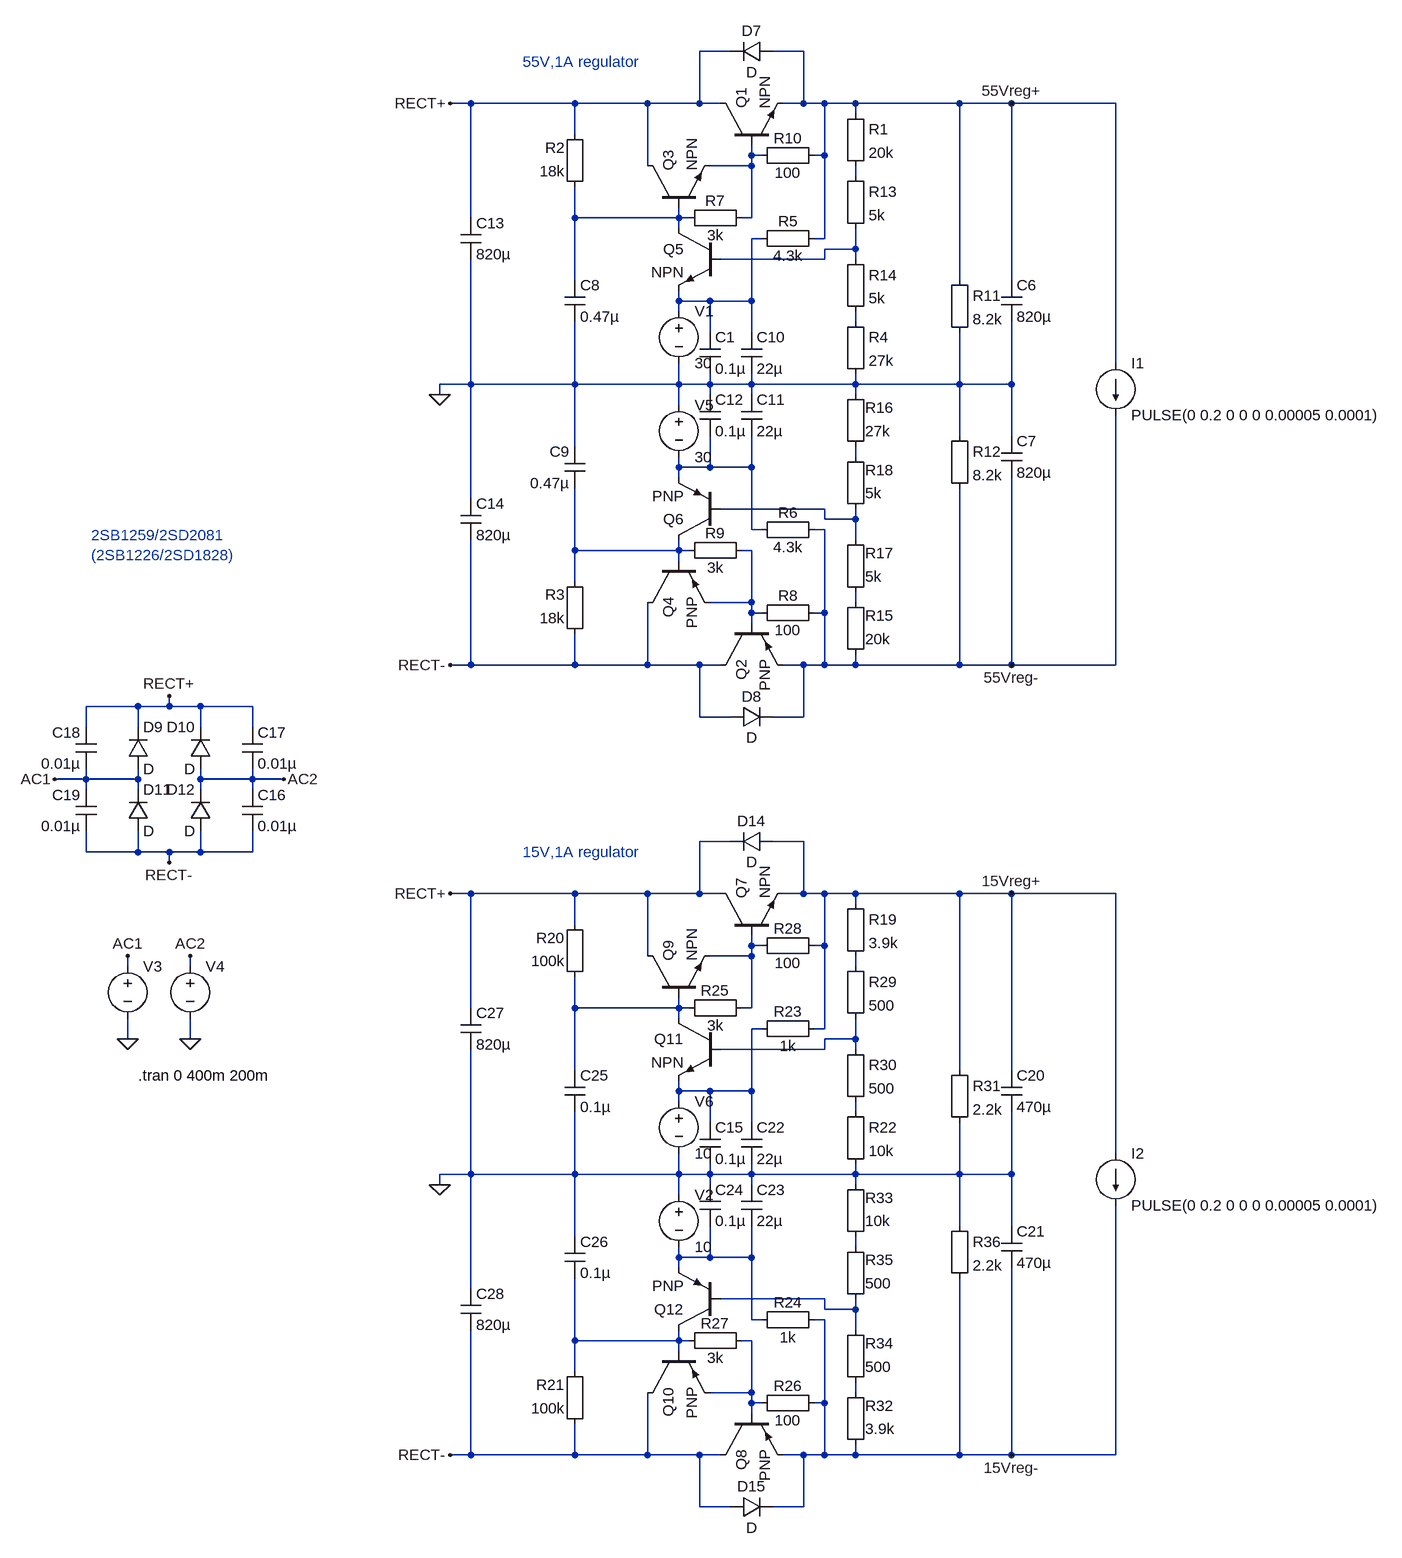
[diagram p0: schematic concept_1_duo.asc]
concept_1_duo.asc, the LTspice schematic file:
Version 4
SHEET 1 880 680
WIRE -2032 -2576 -2080 -2576
WIRE -1920 -2576 -1968 -2576
WIRE -2432 -2496 -2464 -2496
WIRE -2272 -2496 -2432 -2496
WIRE -2160 -2496 -2272 -2496
WIRE -2080 -2496 -2080 -2576
WIRE -2080 -2496 -2160 -2496
WIRE -2048 -2496 -2080 -2496
WIRE -1920 -2496 -1920 -2576
WIRE -1920 -2496 -1952 -2496
WIRE -1888 -2496 -1920 -2496
WIRE -1840 -2496 -1888 -2496
WIRE -1680 -2496 -1840 -2496
WIRE -1600 -2496 -1680 -2496
WIRE -1440 -2496 -1600 -2496
WIRE -1840 -2480 -1840 -2496
WIRE -2272 -2448 -2272 -2496
WIRE -2000 -2416 -2000 -2432
WIRE -1984 -2416 -2000 -2416
WIRE -1888 -2416 -1888 -2496
WIRE -1888 -2416 -1904 -2416
WIRE -2160 -2400 -2160 -2496
WIRE -2000 -2400 -2000 -2416
WIRE -2000 -2400 -2064 -2400
WIRE -1840 -2384 -1840 -2400
WIRE -2432 -2320 -2432 -2496
WIRE -2272 -2320 -2272 -2368
WIRE -2112 -2320 -2112 -2336
WIRE -2112 -2320 -2272 -2320
WIRE -2096 -2320 -2112 -2320
WIRE -2000 -2320 -2000 -2400
WIRE -2000 -2320 -2016 -2320
WIRE -2112 -2304 -2112 -2320
WIRE -1984 -2288 -2000 -2288
WIRE -1888 -2288 -1888 -2416
WIRE -1888 -2288 -1904 -2288
WIRE -1840 -2272 -1840 -2304
WIRE -1840 -2272 -1888 -2272
WIRE -1888 -2256 -1888 -2272
WIRE -1888 -2256 -2048 -2256
WIRE -1840 -2256 -1840 -2272
WIRE -2272 -2224 -2272 -2320
WIRE -1680 -2224 -1680 -2496
WIRE -1600 -2224 -1600 -2496
WIRE -2112 -2192 -2112 -2208
WIRE -2064 -2192 -2112 -2192
WIRE -2000 -2192 -2000 -2288
WIRE -2000 -2192 -2064 -2192
WIRE -2112 -2176 -2112 -2192
WIRE -1840 -2160 -1840 -2176
WIRE -2064 -2144 -2064 -2192
WIRE -2000 -2144 -2000 -2192
WIRE -1440 -2096 -1440 -2496
WIRE -2432 -2064 -2432 -2256
WIRE -2432 -2064 -2480 -2064
WIRE -2272 -2064 -2272 -2160
WIRE -2272 -2064 -2432 -2064
WIRE -2112 -2064 -2112 -2096
WIRE -2112 -2064 -2272 -2064
WIRE -2064 -2064 -2064 -2080
WIRE -2064 -2064 -2112 -2064
WIRE -2000 -2064 -2000 -2080
WIRE -2000 -2064 -2064 -2064
WIRE -1840 -2064 -1840 -2080
WIRE -1840 -2064 -2000 -2064
WIRE -1680 -2064 -1680 -2144
WIRE -1680 -2064 -1840 -2064
WIRE -1600 -2064 -1600 -2160
WIRE -1600 -2064 -1680 -2064
WIRE -2480 -2048 -2480 -2064
WIRE -2064 -2048 -2064 -2064
WIRE -2000 -2048 -2000 -2064
WIRE -1840 -2048 -1840 -2064
WIRE -2112 -2032 -2112 -2064
WIRE -1680 -1984 -1680 -2064
WIRE -1600 -1984 -1600 -2064
WIRE -2272 -1968 -2272 -2064
WIRE -1840 -1952 -1840 -1968
WIRE -2112 -1936 -2112 -1952
WIRE -2064 -1936 -2064 -1984
WIRE -2064 -1936 -2112 -1936
WIRE -2000 -1936 -2000 -1984
WIRE -2000 -1936 -2064 -1936
WIRE -2112 -1920 -2112 -1936
WIRE -2432 -1888 -2432 -2064
WIRE -1888 -1872 -2048 -1872
WIRE -1888 -1856 -1888 -1872
WIRE -1840 -1856 -1840 -1872
WIRE -1840 -1856 -1888 -1856
WIRE -2000 -1840 -2000 -1936
WIRE -1984 -1840 -2000 -1840
WIRE -1888 -1840 -1904 -1840
WIRE -1840 -1824 -1840 -1856
WIRE -2272 -1808 -2272 -1904
WIRE -2112 -1808 -2112 -1824
WIRE -2112 -1808 -2272 -1808
WIRE -2096 -1808 -2112 -1808
WIRE -2000 -1808 -2016 -1808
WIRE -2112 -1792 -2112 -1808
WIRE -2272 -1760 -2272 -1808
WIRE -2000 -1728 -2000 -1808
WIRE -2000 -1728 -2064 -1728
WIRE -1840 -1728 -1840 -1744
WIRE -2000 -1712 -2000 -1728
WIRE -1984 -1712 -2000 -1712
WIRE -1888 -1712 -1888 -1840
WIRE -1888 -1712 -1904 -1712
WIRE -2000 -1696 -2000 -1712
WIRE -2432 -1632 -2432 -1824
WIRE -2432 -1632 -2464 -1632
WIRE -2272 -1632 -2272 -1680
WIRE -2272 -1632 -2432 -1632
WIRE -2160 -1632 -2160 -1728
WIRE -2160 -1632 -2272 -1632
WIRE -2080 -1632 -2160 -1632
WIRE -2048 -1632 -2080 -1632
WIRE -1920 -1632 -1952 -1632
WIRE -1888 -1632 -1888 -1712
WIRE -1888 -1632 -1920 -1632
WIRE -1840 -1632 -1840 -1648
WIRE -1840 -1632 -1888 -1632
WIRE -1680 -1632 -1680 -1904
WIRE -1680 -1632 -1840 -1632
WIRE -1600 -1632 -1600 -1920
WIRE -1600 -1632 -1680 -1632
WIRE -1440 -1632 -1440 -2016
WIRE -1440 -1632 -1600 -1632
WIRE -2944 -1568 -3024 -1568
WIRE -2896 -1568 -2896 -1584
WIRE -2896 -1568 -2944 -1568
WIRE -2848 -1568 -2896 -1568
WIRE -2768 -1568 -2848 -1568
WIRE -2080 -1552 -2080 -1632
WIRE -2032 -1552 -2080 -1552
WIRE -1920 -1552 -1920 -1632
WIRE -1920 -1552 -1968 -1552
WIRE -3024 -1536 -3024 -1568
WIRE -2944 -1536 -2944 -1568
WIRE -2848 -1536 -2848 -1568
WIRE -2768 -1536 -2768 -1568
WIRE -3024 -1456 -3024 -1472
WIRE -3024 -1456 -3072 -1456
WIRE -2944 -1456 -2944 -1472
WIRE -2944 -1456 -3024 -1456
WIRE -2848 -1456 -2848 -1472
WIRE -2768 -1456 -2768 -1472
WIRE -2768 -1456 -2848 -1456
WIRE -2720 -1456 -2768 -1456
WIRE -3024 -1440 -3024 -1456
WIRE -2944 -1440 -2944 -1456
WIRE -2848 -1440 -2848 -1456
WIRE -2768 -1440 -2768 -1456
WIRE -2032 -1360 -2080 -1360
WIRE -1920 -1360 -1968 -1360
WIRE -3024 -1344 -3024 -1376
WIRE -2944 -1344 -2944 -1376
WIRE -2944 -1344 -3024 -1344
WIRE -2896 -1344 -2944 -1344
WIRE -2848 -1344 -2848 -1376
WIRE -2848 -1344 -2896 -1344
WIRE -2768 -1344 -2768 -1376
WIRE -2768 -1344 -2848 -1344
WIRE -2896 -1328 -2896 -1344
WIRE -2432 -1280 -2464 -1280
WIRE -2272 -1280 -2432 -1280
WIRE -2160 -1280 -2272 -1280
WIRE -2080 -1280 -2080 -1360
WIRE -2080 -1280 -2160 -1280
WIRE -2048 -1280 -2080 -1280
WIRE -1920 -1280 -1920 -1360
WIRE -1920 -1280 -1952 -1280
WIRE -1888 -1280 -1920 -1280
WIRE -1840 -1280 -1888 -1280
WIRE -1680 -1280 -1840 -1280
WIRE -1600 -1280 -1680 -1280
WIRE -1440 -1280 -1600 -1280
WIRE -1840 -1264 -1840 -1280
WIRE -2272 -1232 -2272 -1280
WIRE -2000 -1200 -2000 -1216
WIRE -1984 -1200 -2000 -1200
WIRE -1888 -1200 -1888 -1280
WIRE -1888 -1200 -1904 -1200
WIRE -2160 -1184 -2160 -1280
WIRE -2000 -1184 -2000 -1200
WIRE -2000 -1184 -2064 -1184
WIRE -2960 -1168 -2960 -1184
WIRE -2864 -1168 -2864 -1184
WIRE -1840 -1168 -1840 -1184
WIRE -2432 -1104 -2432 -1280
WIRE -2272 -1104 -2272 -1152
WIRE -2112 -1104 -2112 -1120
WIRE -2112 -1104 -2272 -1104
WIRE -2096 -1104 -2112 -1104
WIRE -2000 -1104 -2000 -1184
WIRE -2000 -1104 -2016 -1104
WIRE -2112 -1088 -2112 -1104
WIRE -1984 -1072 -2000 -1072
WIRE -1888 -1072 -1888 -1200
WIRE -1888 -1072 -1904 -1072
WIRE -2960 -1056 -2960 -1088
WIRE -2864 -1056 -2864 -1088
WIRE -1840 -1056 -1840 -1088
WIRE -1840 -1056 -1888 -1056
WIRE -1888 -1040 -1888 -1056
WIRE -1888 -1040 -2048 -1040
WIRE -1840 -1040 -1840 -1056
WIRE -2272 -1008 -2272 -1104
WIRE -1680 -1008 -1680 -1280
WIRE -1600 -1008 -1600 -1280
WIRE -2112 -976 -2112 -992
WIRE -2064 -976 -2112 -976
WIRE -2000 -976 -2000 -1072
WIRE -2000 -976 -2064 -976
WIRE -2112 -960 -2112 -976
WIRE -1840 -944 -1840 -960
WIRE -2064 -928 -2064 -976
WIRE -2000 -928 -2000 -976
WIRE -1440 -880 -1440 -1280
WIRE -2432 -848 -2432 -1040
WIRE -2432 -848 -2480 -848
WIRE -2272 -848 -2272 -944
WIRE -2272 -848 -2432 -848
WIRE -2112 -848 -2112 -880
WIRE -2112 -848 -2272 -848
WIRE -2064 -848 -2064 -864
WIRE -2064 -848 -2112 -848
WIRE -2000 -848 -2000 -864
WIRE -2000 -848 -2064 -848
WIRE -1840 -848 -1840 -864
WIRE -1840 -848 -2000 -848
WIRE -1680 -848 -1680 -928
WIRE -1680 -848 -1840 -848
WIRE -1600 -848 -1600 -944
WIRE -1600 -848 -1680 -848
WIRE -2480 -832 -2480 -848
WIRE -2064 -832 -2064 -848
WIRE -2000 -832 -2000 -848
WIRE -1840 -832 -1840 -848
WIRE -2112 -816 -2112 -848
WIRE -1680 -768 -1680 -848
WIRE -1600 -768 -1600 -848
WIRE -2272 -752 -2272 -848
WIRE -1840 -736 -1840 -752
WIRE -2112 -720 -2112 -736
WIRE -2064 -720 -2064 -768
WIRE -2064 -720 -2112 -720
WIRE -2000 -720 -2000 -768
WIRE -2000 -720 -2064 -720
WIRE -2112 -704 -2112 -720
WIRE -2432 -672 -2432 -848
WIRE -1888 -656 -2048 -656
WIRE -1888 -640 -1888 -656
WIRE -1840 -640 -1840 -656
WIRE -1840 -640 -1888 -640
WIRE -2000 -624 -2000 -720
WIRE -1984 -624 -2000 -624
WIRE -1888 -624 -1904 -624
WIRE -1840 -608 -1840 -640
WIRE -2272 -592 -2272 -688
WIRE -2112 -592 -2112 -608
WIRE -2112 -592 -2272 -592
WIRE -2096 -592 -2112 -592
WIRE -2000 -592 -2016 -592
WIRE -2112 -576 -2112 -592
WIRE -2272 -544 -2272 -592
WIRE -2000 -512 -2000 -592
WIRE -2000 -512 -2064 -512
WIRE -1840 -512 -1840 -528
WIRE -2000 -496 -2000 -512
WIRE -1984 -496 -2000 -496
WIRE -1888 -496 -1888 -624
WIRE -1888 -496 -1904 -496
WIRE -2000 -480 -2000 -496
WIRE -2432 -416 -2432 -608
WIRE -2432 -416 -2464 -416
WIRE -2272 -416 -2272 -464
WIRE -2272 -416 -2432 -416
WIRE -2160 -416 -2160 -512
WIRE -2160 -416 -2272 -416
WIRE -2080 -416 -2160 -416
WIRE -2048 -416 -2080 -416
WIRE -1920 -416 -1952 -416
WIRE -1888 -416 -1888 -496
WIRE -1888 -416 -1920 -416
WIRE -1840 -416 -1840 -432
WIRE -1840 -416 -1888 -416
WIRE -1680 -416 -1680 -688
WIRE -1680 -416 -1840 -416
WIRE -1600 -416 -1600 -704
WIRE -1600 -416 -1680 -416
WIRE -1440 -416 -1440 -800
WIRE -1440 -416 -1600 -416
WIRE -2080 -336 -2080 -416
WIRE -2032 -336 -2080 -336
WIRE -1920 -336 -1920 -416
WIRE -1920 -336 -1968 -336
FLAG -2480 -2048 0
FLAG -2464 -2496 RECT+
FLAG -2464 -1632 RECT-
FLAG -1600 -2496 55Vreg+
FLAG -1600 -1632 55Vreg-
FLAG -2480 -832 0
FLAG -2864 -1056 0
FLAG -2960 -1056 0
FLAG -2896 -1584 RECT+
FLAG -2896 -1328 RECT-
FLAG -3072 -1456 AC1
FLAG -2720 -1456 AC2
FLAG -2960 -1184 AC1
FLAG -2864 -1184 AC2
FLAG -2464 -1280 RECT+
FLAG -2464 -416 RECT-
FLAG -1600 -1280 15Vreg+
FLAG -1600 -416 15Vreg-
SYMBOL npn -2048 -2432 R270
SYMATTR InstName Q1
SYMBOL pnp -2048 -1696 M90
SYMATTR InstName Q2
SYMBOL Misc\\EuropeanResistor -1856 -2496 R0
SYMATTR InstName R1
SYMATTR Value 20k
SYMBOL npn -2160 -2336 R270
SYMATTR InstName Q3
SYMBOL pnp -2160 -1792 M90
SYMATTR InstName Q4
SYMBOL npn -2048 -2304 M0
SYMATTR InstName Q5
SYMBOL pnp -2048 -1824 R180
SYMATTR InstName Q6
SYMBOL Misc\\EuropeanResistor -2256 -2352 R180
WINDOW 0 31 76 Left 2
WINDOW 3 31 40 Left 2
SYMATTR InstName R2
SYMATTR Value 18k
SYMBOL Misc\\EuropeanResistor -2256 -1664 R180
WINDOW 0 31 76 Left 2
WINDOW 3 31 40 Left 2
SYMATTR InstName R3
SYMATTR Value 18k
SYMBOL Misc\\EuropeanResistor -1856 -2176 R0
SYMATTR InstName R4
SYMATTR Value 27k
SYMBOL cap -2080 -2144 R0
SYMATTR InstName C1
SYMATTR Value 0.1µ
SYMATTR SpiceLine V=100
SYMBOL cap -1616 -2224 R0
SYMATTR InstName C6
SYMATTR Value 820µ
SYMBOL cap -1616 -1984 R0
SYMATTR InstName C7
SYMATTR Value 820µ
SYMBOL cap -2288 -2224 R0
SYMATTR InstName C8
SYMATTR Value 0.47µ
SYMBOL cap -2256 -1904 R180
WINDOW 0 24 56 Left 2
WINDOW 3 24 8 Left 2
SYMATTR InstName C9
SYMATTR Value 0.47µ
SYMBOL Misc\\EuropeanResistor -1888 -2304 R90
WINDOW 0 5 56 VBottom 2
WINDOW 3 27 56 VTop 2
SYMATTR InstName R5
SYMATTR Value 4.3k
SYMBOL Misc\\EuropeanResistor -2000 -1824 R270
WINDOW 0 27 56 VTop 2
WINDOW 3 5 56 VBottom 2
SYMATTR InstName R6
SYMATTR Value 4.3k
SYMBOL cap -2016 -2144 R0
SYMATTR InstName C10
SYMATTR Value 22µ
SYMATTR SpiceLine V=63
SYMBOL Misc\\EuropeanResistor -2112 -2304 R270
WINDOW 0 27 56 VTop 2
WINDOW 3 5 56 VBottom 2
SYMATTR InstName R7
SYMATTR Value 3k
SYMBOL Misc\\EuropeanResistor -2000 -1696 R270
WINDOW 0 27 56 VTop 2
WINDOW 3 5 56 VBottom 2
SYMATTR InstName R8
SYMATTR Value 100
SYMBOL Misc\\EuropeanResistor -2112 -1792 R270
WINDOW 0 27 56 VTop 2
WINDOW 3 5 56 VBottom 2
SYMATTR InstName R9
SYMATTR Value 3k
SYMBOL Misc\\EuropeanResistor -2000 -2400 R270
WINDOW 0 27 56 VTop 2
WINDOW 3 5 56 VBottom 2
SYMATTR InstName R10
SYMATTR Value 100
SYMBOL Misc\\EuropeanResistor -1696 -2240 R0
SYMATTR InstName R11
SYMATTR Value 8.2k
SYMATTR SpiceLine pwr=0.5
SYMBOL Misc\\EuropeanResistor -1696 -2000 R0
SYMATTR InstName R12
SYMATTR Value 8.2k
SYMATTR SpiceLine pwr=0.5
SYMBOL cap -2016 -2048 R0
SYMATTR InstName C11
SYMATTR Value 22µ
SYMATTR SpiceLine V=63
SYMBOL cap -2080 -2048 R0
SYMATTR InstName C12
SYMATTR Value 0.1µ
SYMATTR SpiceLine V=100
SYMBOL Misc\\EuropeanResistor -1856 -2400 R0
SYMATTR InstName R13
SYMATTR Value 5k
SYMBOL Misc\\EuropeanResistor -1856 -2272 R0
SYMATTR InstName R14
SYMATTR Value 5k
SYMBOL Misc\\EuropeanResistor -1856 -1632 M180
WINDOW 0 31 76 Left 2
WINDOW 3 31 40 Left 2
SYMATTR InstName R15
SYMATTR Value 20k
SYMBOL Misc\\EuropeanResistor -1856 -1952 M180
WINDOW 0 31 76 Left 2
WINDOW 3 31 40 Left 2
SYMATTR InstName R16
SYMATTR Value 27k
SYMBOL Misc\\EuropeanResistor -1856 -1728 M180
WINDOW 0 31 76 Left 2
WINDOW 3 31 40 Left 2
SYMATTR InstName R17
SYMATTR Value 5k
SYMBOL Misc\\EuropeanResistor -1856 -1856 M180
WINDOW 0 31 76 Left 2
WINDOW 3 31 40 Left 2
SYMATTR InstName R18
SYMATTR Value 5k
SYMBOL diode -1968 -2592 R90
WINDOW 0 0 32 VBottom 2
WINDOW 3 32 32 VTop 2
SYMATTR InstName D7
SYMBOL diode -2032 -1536 R270
WINDOW 0 32 32 VTop 2
WINDOW 3 0 32 VBottom 2
SYMATTR InstName D8
SYMBOL cap -2448 -2320 R0
SYMATTR InstName C13
SYMATTR Value 820µ
SYMBOL cap -2448 -1888 R0
SYMATTR InstName C14
SYMATTR Value 820µ
SYMBOL npn -2048 -1216 R270
SYMATTR InstName Q7
SYMBOL pnp -2048 -480 M90
SYMATTR InstName Q8
SYMBOL Misc\\EuropeanResistor -1856 -1280 R0
SYMATTR InstName R19
SYMATTR Value 3.9k
SYMBOL npn -2160 -1120 R270
SYMATTR InstName Q9
SYMBOL pnp -2160 -576 M90
SYMATTR InstName Q10
SYMBOL npn -2048 -1088 M0
SYMATTR InstName Q11
SYMBOL pnp -2048 -608 R180
SYMATTR InstName Q12
SYMBOL Misc\\EuropeanResistor -2256 -1136 R180
WINDOW 0 31 76 Left 2
WINDOW 3 31 40 Left 2
SYMATTR InstName R20
SYMATTR Value 100k
SYMBOL Misc\\EuropeanResistor -2256 -448 R180
WINDOW 0 31 76 Left 2
WINDOW 3 31 40 Left 2
SYMATTR InstName R21
SYMATTR Value 100k
SYMBOL Misc\\EuropeanResistor -1856 -960 R0
SYMATTR InstName R22
SYMATTR Value 10k
SYMBOL cap -2080 -928 R0
SYMATTR InstName C15
SYMATTR Value 0.1µ
SYMATTR SpiceLine V=100
SYMBOL voltage -2960 -1184 R0
WINDOW 123 0 0 Left 2
WINDOW 39 0 0 Left 2
WINDOW 3 24 96 Invisible 2
SYMATTR Value SINE(0 75 50 0 0 0)
SYMATTR InstName V3
SYMBOL diode -2960 -1472 M180
WINDOW 0 24 64 Left 2
WINDOW 3 24 0 Left 2
SYMATTR InstName D9
SYMBOL diode -2832 -1472 R180
WINDOW 0 24 64 Left 2
WINDOW 3 24 0 Left 2
SYMATTR InstName D10
SYMBOL diode -2960 -1376 M180
WINDOW 0 24 64 Left 2
WINDOW 3 24 0 Left 2
SYMATTR InstName D11
SYMBOL diode -2832 -1376 R180
WINDOW 0 24 64 Left 2
WINDOW 3 24 0 Left 2
SYMATTR InstName D12
SYMBOL cap -2784 -1440 R0
SYMATTR InstName C16
SYMATTR Value 0.01µ
SYMBOL cap -2784 -1536 R0
SYMATTR InstName C17
SYMATTR Value 0.01µ
SYMBOL cap -3008 -1536 M0
SYMATTR InstName C18
SYMATTR Value 0.01µ
SYMBOL cap -3008 -1440 M0
SYMATTR InstName C19
SYMATTR Value 0.01µ
SYMBOL voltage -2864 -1184 R0
WINDOW 123 0 0 Left 2
WINDOW 39 0 0 Left 2
WINDOW 3 24 96 Invisible 2
SYMATTR Value SINE(0 -75 50 0 0 0)
SYMATTR InstName V4
SYMBOL cap -1616 -1008 R0
SYMATTR InstName C20
SYMATTR Value 470µ
SYMBOL cap -1616 -768 R0
SYMATTR InstName C21
SYMATTR Value 470µ
SYMBOL Misc\\EuropeanResistor -1888 -1088 R90
WINDOW 0 5 56 VBottom 2
WINDOW 3 27 56 VTop 2
SYMATTR InstName R23
SYMATTR Value 1k
SYMBOL Misc\\EuropeanResistor -2000 -608 R270
WINDOW 0 27 56 VTop 2
WINDOW 3 5 56 VBottom 2
SYMATTR InstName R24
SYMATTR Value 1k
SYMBOL cap -2016 -928 R0
SYMATTR InstName C22
SYMATTR Value 22µ
SYMATTR SpiceLine V=63
SYMBOL Misc\\EuropeanResistor -2112 -1088 R270
WINDOW 0 27 56 VTop 2
WINDOW 3 5 56 VBottom 2
SYMATTR InstName R25
SYMATTR Value 3k
SYMBOL Misc\\EuropeanResistor -2000 -480 R270
WINDOW 0 27 56 VTop 2
WINDOW 3 5 56 VBottom 2
SYMATTR InstName R26
SYMATTR Value 100
SYMBOL Misc\\EuropeanResistor -2112 -576 R270
WINDOW 0 27 56 VTop 2
WINDOW 3 5 56 VBottom 2
SYMATTR InstName R27
SYMATTR Value 3k
SYMBOL Misc\\EuropeanResistor -2000 -1184 R270
WINDOW 0 27 56 VTop 2
WINDOW 3 5 56 VBottom 2
SYMATTR InstName R28
SYMATTR Value 100
SYMBOL cap -2016 -832 R0
SYMATTR InstName C23
SYMATTR Value 22µ
SYMATTR SpiceLine V=63
SYMBOL cap -2080 -832 R0
SYMATTR InstName C24
SYMATTR Value 0.1µ
SYMATTR SpiceLine V=100
SYMBOL Misc\\EuropeanResistor -1856 -1184 R0
SYMATTR InstName R29
SYMATTR Value 500
SYMBOL Misc\\EuropeanResistor -1856 -1056 R0
SYMATTR InstName R30
SYMATTR Value 500
SYMBOL diode -1968 -1376 R90
WINDOW 0 0 32 VBottom 2
WINDOW 3 32 32 VTop 2
SYMATTR InstName D14
SYMBOL diode -2032 -320 R270
WINDOW 0 32 32 VTop 2
WINDOW 3 0 32 VBottom 2
SYMATTR InstName D15
SYMBOL Misc\\EuropeanResistor -1696 -1024 R0
SYMATTR InstName R31
SYMATTR Value 2.2k
SYMBOL Misc\\EuropeanResistor -1856 -416 M180
WINDOW 0 31 76 Left 2
WINDOW 3 31 40 Left 2
SYMATTR InstName R32
SYMATTR Value 3.9k
SYMBOL Misc\\EuropeanResistor -1856 -736 M180
WINDOW 0 31 76 Left 2
WINDOW 3 31 40 Left 2
SYMATTR InstName R33
SYMATTR Value 10k
SYMBOL Misc\\EuropeanResistor -1856 -512 M180
WINDOW 0 31 76 Left 2
WINDOW 3 31 40 Left 2
SYMATTR InstName R34
SYMATTR Value 500
SYMBOL Misc\\EuropeanResistor -1856 -640 M180
WINDOW 0 31 76 Left 2
WINDOW 3 31 40 Left 2
SYMATTR InstName R35
SYMATTR Value 500
SYMBOL cap -2288 -1008 R0
SYMATTR InstName C25
SYMATTR Value 0.1µ
SYMATTR SpiceLine V=100
SYMBOL cap -2288 -752 R0
SYMATTR InstName C26
SYMATTR Value 0.1µ
SYMATTR SpiceLine V=100
SYMBOL cap -2448 -1104 R0
SYMATTR InstName C27
SYMATTR Value 820µ
SYMBOL cap -2448 -672 R0
SYMATTR InstName C28
SYMATTR Value 820µ
SYMBOL Misc\\EuropeanResistor -1696 -784 R0
SYMATTR InstName R36
SYMATTR Value 2.2k
SYMBOL voltage -2112 -2192 R0
WINDOW 123 0 0 Left 2
WINDOW 39 0 0 Left 2
SYMATTR InstName V1
SYMATTR Value 30
SYMBOL voltage -2112 -832 R0
WINDOW 123 0 0 Left 2
WINDOW 39 0 0 Left 2
SYMATTR InstName V2
SYMATTR Value 10
SYMBOL voltage -2112 -2048 R0
WINDOW 123 0 0 Left 2
WINDOW 39 0 0 Left 2
SYMATTR InstName V5
SYMATTR Value 30
SYMBOL voltage -2112 -976 R0
WINDOW 123 0 0 Left 2
WINDOW 39 0 0 Left 2
SYMATTR InstName V6
SYMATTR Value 10
SYMBOL current -1440 -2096 R0
WINDOW 123 0 0 Left 2
WINDOW 39 0 0 Left 2
SYMATTR InstName I1
SYMATTR Value PULSE(0 0.2 0 0 0 0.00005 0.0001)
SYMBOL current -1440 -880 R0
WINDOW 123 0 0 Left 2
WINDOW 39 0 0 Left 2
SYMATTR InstName I2
SYMATTR Value PULSE(0 0.2 0 0 0 0.00005 0.0001)
TEXT -2352 -2560 Left 2 ;55V,1A regulator
TEXT -2352 -1344 Left 2 ;15V,1A regulator
TEXT -2944 -1000 Left 2 !.tran 0 400m 200m
TEXT -3016 -1832 Left 2 ;2SB1259/2SD2081\n(2SB1226/2SD1828)

The netlist it stands for:
* concept_1_duo.asc
Q1 RECT+ N001 55Vreg+ 0 NPN
Q2 RECT- N011 55Vreg- 0 PNP
R1 55Vreg+ N002 20k
Q3 RECT+ N003 N001 0 NPN
Q4 RECT- N010 N011 0 PNP
Q5 N003 N005 N004 0 NPN
Q6 N010 N009 N008 0 PNP
R2 N003 RECT+ 18k
R3 RECT- N010 18k
R4 N006 0 27k
C1 N004 0 0.1µ V=100
C6 55Vreg+ 0 820µ
C7 0 55Vreg- 820µ
C8 N003 0 0.47µ
C9 N010 0 0.47µ
R5 55Vreg+ N004 4.3k
R6 N008 55Vreg- 4.3k
C10 N004 0 22µ V=63
R7 N003 N001 3k
R8 N011 55Vreg- 100
R9 N010 N011 3k
R10 N001 55Vreg+ 100
R11 55Vreg+ 0 8.2k pwr=0.5
R12 0 55Vreg- 8.2k pwr=0.5
C11 0 N008 22µ V=63
C12 0 N008 0.1µ V=100
R13 N002 N005 5k
R14 N005 N006 5k
R15 55Vreg- N012 20k
R16 N007 0 27k
R17 N012 N009 5k
R18 N009 N007 5k
D7 55Vreg+ RECT+ D
D8 RECT- 55Vreg- D
C13 RECT+ 0 820µ
C14 0 RECT- 820µ
Q7 RECT+ N013 15Vreg+ 0 NPN
Q8 RECT- N023 15Vreg- 0 PNP
R19 15Vreg+ N014 3.9k
Q9 RECT+ N015 N013 0 NPN
Q10 RECT- N022 N023 0 PNP
Q11 N015 N017 N016 0 NPN
Q12 N022 N021 N020 0 PNP
R20 N015 RECT+ 100k
R21 RECT- N022 100k
R22 N018 0 10k
C15 N016 0 0.1µ V=100
V3 AC1 0 SINE(0 75 50 0 0 0)
D9 AC1 RECT+ D
D10 AC2 RECT+ D
D11 RECT- AC1 D
D12 RECT- AC2 D
C16 AC2 RECT- 0.01µ
C17 RECT+ AC2 0.01µ
C18 RECT+ AC1 0.01µ
C19 AC1 RECT- 0.01µ
V4 AC2 0 SINE(0 -75 50 0 0 0)
C20 15Vreg+ 0 470µ
C21 0 15Vreg- 470µ
R23 15Vreg+ N016 1k
R24 N020 15Vreg- 1k
C22 N016 0 22µ V=63
R25 N015 N013 3k
R26 N023 15Vreg- 100
R27 N022 N023 3k
R28 N013 15Vreg+ 100
C23 0 N020 22µ V=63
C24 0 N020 0.1µ V=100
R29 N014 N017 500
R30 N017 N018 500
D14 15Vreg+ RECT+ D
D15 RECT- 15Vreg- D
R31 15Vreg+ 0 2.2k
R32 15Vreg- N024 3.9k
R33 N019 0 10k
R34 N024 N021 500
R35 N021 N019 500
C25 N015 0 0.1µ V=100
C26 0 N022 0.1µ V=100
C27 RECT+ 0 820µ
C28 0 RECT- 820µ
R36 0 15Vreg- 2.2k
V1 N004 0 30
V2 0 N020 10
V5 0 N008 30
V6 N016 0 10
I1 55Vreg+ 55Vreg- PULSE(0 0.2 0 0 0 0.00005 0.0001)
I2 15Vreg+ 15Vreg- PULSE(0 0.2 0 0 0 0.00005 0.0001)
.model D D
.lib standard.dio
.model NPN NPN
.model PNP PNP
.lib standard.bjt
* 55V,1A regulator
* 15V,1A regulator
.tran 0 400m 200m
* 2SB1259/2SD2081
* (2SB1226/2SD1828)
.backanno
.end